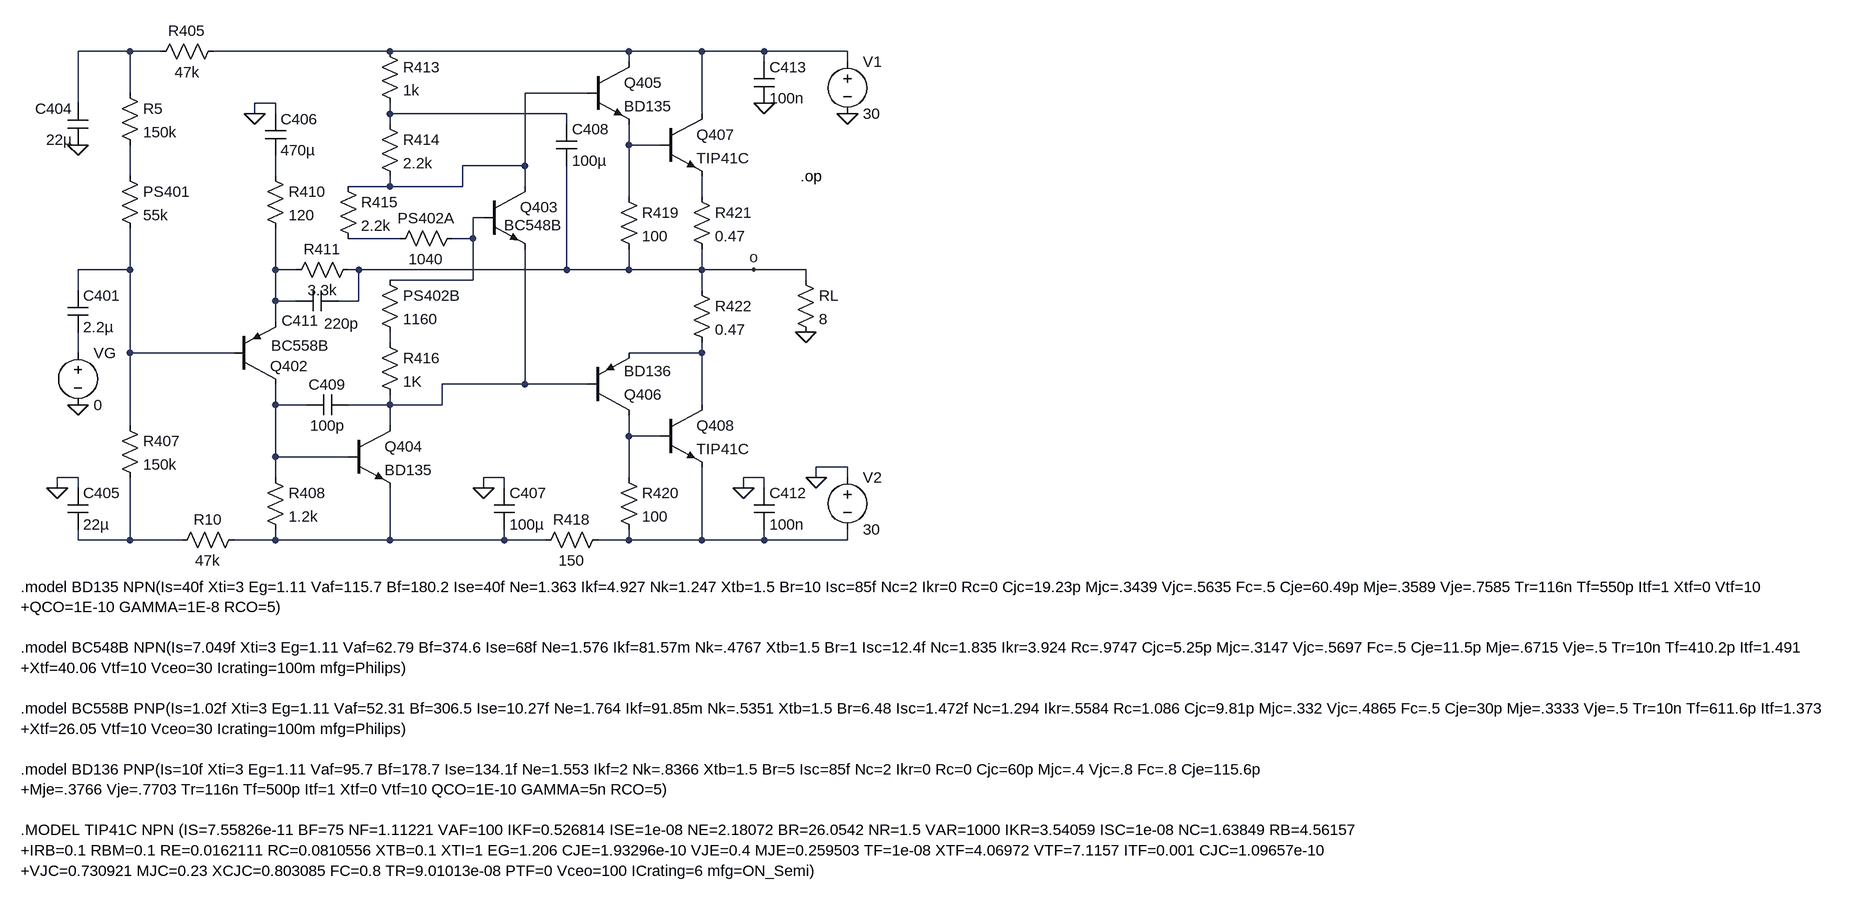
[diagram p0: schematic Polarizacion.asc]
Polarizacion.asc, the LTspice schematic file:
Version 4
SHEET 1 2364 864
WIRE -688 -368 -768 -368
WIRE -640 -368 -688 -368
WIRE -288 -368 -560 -368
WIRE 80 -368 -288 -368
WIRE 192 -368 80 -368
WIRE 288 -368 192 -368
WIRE 416 -368 288 -368
WIRE 80 -352 80 -368
WIRE 288 -352 288 -368
WIRE 416 -352 416 -368
WIRE -688 -304 -688 -368
WIRE 16 -304 -80 -304
WIRE -768 -288 -768 -368
WIRE -464 -288 -496 -288
WIRE -496 -272 -496 -288
WIRE -464 -272 -464 -288
WIRE -288 -272 -288 -288
WIRE -16 -272 -288 -272
WIRE 192 -272 192 -368
WIRE -288 -256 -288 -272
WIRE -16 -256 -16 -272
WIRE 80 -224 80 -256
WIRE 128 -224 80 -224
WIRE -80 -192 -80 -304
WIRE -80 -192 -176 -192
WIRE -688 -176 -688 -224
WIRE -464 -176 -464 -208
WIRE -288 -160 -288 -176
WIRE -288 -160 -352 -160
WIRE -176 -160 -176 -192
WIRE -176 -160 -288 -160
WIRE -80 -160 -80 -192
WIRE 80 -144 80 -224
WIRE 192 -144 192 -176
WIRE -144 -112 -160 -112
WIRE -272 -80 -352 -80
WIRE -160 -80 -160 -112
WIRE -160 -80 -192 -80
WIRE -688 -32 -688 -96
WIRE -688 -32 -768 -32
WIRE -464 -32 -464 -96
WIRE -432 -32 -464 -32
WIRE -336 -32 -352 -32
WIRE -16 -32 -16 -192
WIRE -16 -32 -336 -32
WIRE 80 -32 80 -64
WIRE 80 -32 -16 -32
WIRE 192 -32 192 -64
WIRE 192 -32 80 -32
WIRE 272 -32 192 -32
WIRE 352 -32 272 -32
WIRE -160 -16 -160 -80
WIRE -160 -16 -288 -16
WIRE 352 -16 352 -32
WIRE -768 0 -768 -32
WIRE 192 0 192 -32
WIRE -464 16 -464 -32
WIRE -432 16 -464 16
WIRE -336 16 -336 -32
WIRE -336 16 -368 16
WIRE -464 48 -464 16
WIRE -288 80 -288 64
WIRE -768 96 -768 64
WIRE -688 96 -688 -32
WIRE -528 96 -688 96
WIRE 192 96 192 80
WIRE 192 96 80 96
WIRE -80 144 -80 -64
WIRE -80 144 -208 144
WIRE 16 144 -80 144
WIRE -464 176 -464 144
WIRE -416 176 -464 176
WIRE -288 176 -288 160
WIRE -288 176 -352 176
WIRE -208 176 -208 144
WIRE -208 176 -288 176
WIRE 192 176 192 96
WIRE -688 208 -688 96
WIRE -288 208 -288 176
WIRE 80 224 80 192
WIRE 128 224 80 224
WIRE -464 256 -464 176
WIRE -352 256 -464 256
WIRE 416 272 368 272
WIRE -768 288 -800 288
WIRE -464 288 -464 256
WIRE -112 288 -144 288
WIRE 80 288 80 224
WIRE 288 288 256 288
WIRE 368 288 368 272
WIRE 416 288 416 272
WIRE -800 304 -800 288
WIRE -768 304 -768 288
WIRE -144 304 -144 288
WIRE -112 304 -112 288
WIRE 256 304 256 288
WIRE 288 304 288 288
WIRE -768 384 -768 368
WIRE -688 384 -688 288
WIRE -688 384 -768 384
WIRE -608 384 -688 384
WIRE -464 384 -464 368
WIRE -464 384 -528 384
WIRE -288 384 -288 304
WIRE -288 384 -464 384
WIRE -112 384 -112 368
WIRE -112 384 -288 384
WIRE -48 384 -112 384
WIRE 80 384 80 368
WIRE 80 384 32 384
WIRE 192 384 192 272
WIRE 192 384 80 384
WIRE 288 384 288 368
WIRE 288 384 192 384
WIRE 416 384 416 368
WIRE 416 384 288 384
FLAG -768 -224 0
FLAG -768 176 0
FLAG -496 -272 0
FLAG 288 -288 0
FLAG 256 304 0
FLAG 368 288 0
FLAG -800 304 0
FLAG 352 64 0
FLAG 416 -272 0
FLAG -144 304 0
FLAG 272 -32 o
SYMBOL res -704 -320 R0
SYMATTR InstName R5
SYMATTR Value 150k
SYMBOL res -544 -384 R90
WINDOW 0 0 56 VBottom 2
WINDOW 3 32 56 VTop 2
SYMATTR InstName R405
SYMATTR Value 47k
SYMBOL res -704 -192 R0
SYMATTR InstName PS401
SYMATTR Value 55k
SYMBOL cap -752 -224 R180
WINDOW 0 24 56 Left 2
WINDOW 3 24 8 Left 2
SYMATTR InstName C404
SYMATTR Value 22µ
SYMBOL res -704 192 R0
SYMATTR InstName R407
SYMATTR Value 150k
SYMBOL voltage -768 80 R0
SYMATTR InstName VG
SYMATTR Value 0
SYMBOL cap -784 0 R0
SYMATTR InstName C401
SYMATTR Value 2.2µ
SYMBOL pnp -528 144 M180
WINDOW 0 56 28 Left 2
WINDOW 3 57 59 Left 2
SYMATTR InstName Q402
SYMATTR Value BC558B
SYMBOL res -480 -192 R0
SYMATTR InstName R410
SYMATTR Value 120
SYMBOL cap -480 -272 R0
SYMATTR InstName C406
SYMATTR Value 470µ
SYMBOL res -480 272 R0
SYMATTR InstName R408
SYMATTR Value 1.2k
SYMBOL res -448 -16 R270
WINDOW 0 32 56 VTop 2
WINDOW 3 0 56 VBottom 2
SYMATTR InstName R411
SYMATTR Value 3.3k
SYMBOL res -304 -384 R0
SYMATTR InstName R413
SYMATTR Value 1k
SYMBOL res -304 -272 R0
SYMATTR InstName R414
SYMATTR Value 2.2k
SYMBOL res -368 -176 R0
SYMATTR InstName R415
SYMATTR Value 2.2k
SYMBOL res -304 -32 R0
SYMATTR InstName PS402B
SYMATTR Value 1160
SYMBOL res -304 64 R0
SYMATTR InstName R416
SYMATTR Value 1K
SYMBOL npn -352 208 R0
SYMATTR InstName Q404
SYMATTR Value BD135
SYMBOL npn -144 -160 R0
WINDOW 3 32 59 Left 2
SYMATTR Value BC548B
SYMATTR InstName Q403
SYMBOL npn 16 -352 R0
SYMATTR InstName Q405
SYMATTR Value BD135
SYMBOL npn 128 -272 R0
SYMATTR InstName Q407
SYMATTR Value TIP41C
SYMBOL npn 128 176 R0
SYMATTR InstName Q408
SYMATTR Value TIP41C
SYMBOL pnp 16 192 M180
SYMATTR InstName Q406
SYMATTR Value BD136
SYMBOL res 176 -160 R0
SYMATTR InstName R421
SYMATTR Value 0.47
SYMBOL res 64 -160 R0
SYMATTR InstName R419
SYMATTR Value 100
SYMBOL res 64 272 R0
SYMATTR InstName R420
SYMATTR Value 100
SYMBOL res 176 -16 R0
SYMATTR InstName R422
SYMATTR Value 0.47
SYMBOL cap 272 -352 R0
SYMATTR InstName C413
SYMATTR Value 100n
SYMBOL cap 272 304 R0
SYMATTR InstName C412
SYMATTR Value 100n
SYMBOL voltage 416 -368 R0
SYMATTR InstName V1
SYMATTR Value 30
SYMBOL voltage 416 272 R0
SYMATTR InstName V2
SYMATTR Value 30
SYMBOL res 336 -32 R0
SYMATTR InstName RL
SYMATTR Value 8
SYMBOL res -64 400 R270
WINDOW 0 32 56 VTop 2
WINDOW 3 0 56 VBottom 2
SYMATTR InstName R418
SYMATTR Value 150
SYMBOL res -624 400 R270
WINDOW 0 32 56 VTop 2
WINDOW 3 0 56 VBottom 2
SYMATTR InstName R10
SYMATTR Value 47k
SYMBOL cap -784 304 R0
SYMATTR InstName C405
SYMATTR Value 22µ
SYMBOL cap -128 304 R0
SYMATTR InstName C407
SYMATTR Value 100µ
SYMBOL cap -32 -256 R0
SYMATTR InstName C408
SYMATTR Value 100µ
SYMBOL cap -368 0 R90
WINDOW 0 62 58 VBottom 2
WINDOW 3 35 -6 VTop 2
SYMATTR InstName C411
SYMATTR Value 220p
SYMBOL cap -352 160 R90
WINDOW 0 0 32 VBottom 2
WINDOW 3 32 32 VTop 2
SYMATTR InstName C409
SYMATTR Value 100p
SYMBOL res -288 -64 R270
WINDOW 0 32 56 VTop 2
WINDOW 3 0 56 VBottom 2
SYMATTR InstName PS402A
SYMATTR Value 1040
TEXT 344 -176 Left 2 !.op
TEXT -856 456 Left 2 !.model BD135 NPN(Is=40f Xti=3 Eg=1.11 Vaf=115.7 Bf=180.2 Ise=40f Ne=1.363 Ikf=4.927 Nk=1.247 Xtb=1.5 Br=10 Isc=85f Nc=2 Ikr=0 Rc=0 Cjc=19.23p Mjc=.3439 Vjc=.5635 Fc=.5 Cje=60.49p Mje=.3589 Vje=.7585 Tr=116n Tf=550p Itf=1 Xtf=0 Vtf=10 \n+QCO=1E-10 GAMMA=1E-8 RCO=5)\n \n.model BC548B NPN(Is=7.049f Xti=3 Eg=1.11 Vaf=62.79 Bf=374.6 Ise=68f Ne=1.576 Ikf=81.57m Nk=.4767 Xtb=1.5 Br=1 Isc=12.4f Nc=1.835 Ikr=3.924 Rc=.9747 Cjc=5.25p Mjc=.3147 Vjc=.5697 Fc=.5 Cje=11.5p Mje=.6715 Vje=.5 Tr=10n Tf=410.2p Itf=1.491 \n+Xtf=40.06 Vtf=10 Vceo=30 Icrating=100m mfg=Philips)\n \n.model BC558B PNP(Is=1.02f Xti=3 Eg=1.11 Vaf=52.31 Bf=306.5 Ise=10.27f Ne=1.764 Ikf=91.85m Nk=.5351 Xtb=1.5 Br=6.48 Isc=1.472f Nc=1.294 Ikr=.5584 Rc=1.086 Cjc=9.81p Mjc=.332 Vjc=.4865 Fc=.5 Cje=30p Mje=.3333 Vje=.5 Tr=10n Tf=611.6p Itf=1.373 \n+Xtf=26.05 Vtf=10 Vceo=30 Icrating=100m mfg=Philips)\n \n.model BD136 PNP(Is=10f Xti=3 Eg=1.11 Vaf=95.7 Bf=178.7 Ise=134.1f Ne=1.553 Ikf=2 Nk=.8366 Xtb=1.5 Br=5 Isc=85f Nc=2 Ikr=0 Rc=0 Cjc=60p Mjc=.4 Vjc=.8 Fc=.8 Cje=115.6p\n+Mje=.3766 Vje=.7703 Tr=116n Tf=500p Itf=1 Xtf=0 Vtf=10 QCO=1E-10 GAMMA=5n RCO=5)\n \n.MODEL TIP41C NPN (IS=7.55826e-11 BF=75 NF=1.11221 VAF=100 IKF=0.526814 ISE=1e-08 NE=2.18072 BR=26.0542 NR=1.5 VAR=1000 IKR=3.54059 ISC=1e-08 NC=1.63849 RB=4.56157\n+IRB=0.1 RBM=0.1 RE=0.0162111 RC=0.0810556 XTB=0.1 XTI=1 EG=1.206 CJE=1.93296e-10 VJE=0.4 MJE=0.259503 TF=1e-08 XTF=4.06972 VTF=7.1157 ITF=0.001 CJC=1.09657e-10\n+VJC=0.730921 MJC=0.23 XCJC=0.803085 FC=0.8 TR=9.01013e-08 PTF=0 Vceo=100 ICrating=6 mfg=ON_Semi)

The netlist it stands for:
* Polarizacion.asc
R5 N001 N006 150k
R405 N002 N001 47k
R§PS401 N006 N011 55k
C404 0 N001 22µ
R407 N011 N019 150k
VG N014 0 0
C401 N011 N014 2.2µ
Q402 N017 N011 N012 0 BC558B
R410 N007 N012 120
C406 0 N007 470µ
R408 N017 N020 1.2k
R411 N012 o 3.3k
R413 N002 N004 1k
R414 N004 N003 2.2k
R415 N003 N010 2.2k
R§PS402B N009 N013 1160
R416 N013 N016 1K
Q404 N016 N017 N020 0 BD135
Q403 N003 N009 N016 0 BC548B
Q405 N002 N003 N005 0 BD135
Q407 N002 N005 N008 0 TIP41C
Q408 N015 N018 N021 0 TIP41C
Q406 N018 N016 N015 0 BD136
R421 N008 o 0.47
R419 N005 o 100
R420 N018 N021 100
R422 o N015 0.47
C413 N002 0 100n
C412 0 N021 100n
V1 N002 0 30
V2 0 N021 30
RL o 0 8
R418 N020 N021 150
R10 N019 N020 47k
C405 0 N019 22µ
C407 0 N020 100µ
C408 N004 o 100µ
C411 o N012 220p
C409 N016 N017 100p
R§PS402A N010 N009 1040
.model NPN NPN
.model PNP PNP
.lib standard.bjt
.op
.model BD135 NPN(Is=40f Xti=3 Eg=1.11 Vaf=115.7 Bf=180.2 Ise=40f Ne=1.363 Ikf=4.927 Nk=1.247 Xtb=1.5 Br=10 Isc=85f Nc=2 Ikr=0 Rc=0 Cjc=19.23p Mjc=.3439 Vjc=.5635 Fc=.5 Cje=60.49p Mje=.3589 Vje=.7585 Tr=116n Tf=550p Itf=1 Xtf=0 Vtf=10
+QCO=1E-10 GAMMA=1E-8 RCO=5)
.model BC548B NPN(Is=7.049f Xti=3 Eg=1.11 Vaf=62.79 Bf=374.6 Ise=68f Ne=1.576 Ikf=81.57m Nk=.4767 Xtb=1.5 Br=1 Isc=12.4f Nc=1.835 Ikr=3.924 Rc=.9747 Cjc=5.25p Mjc=.3147 Vjc=.5697 Fc=.5 Cje=11.5p Mje=.6715 Vje=.5 Tr=10n Tf=410.2p Itf=1.491
+Xtf=40.06 Vtf=10 Vceo=30 Icrating=100m mfg=Philips)
.model BC558B PNP(Is=1.02f Xti=3 Eg=1.11 Vaf=52.31 Bf=306.5 Ise=10.27f Ne=1.764 Ikf=91.85m Nk=.5351 Xtb=1.5 Br=6.48 Isc=1.472f Nc=1.294 Ikr=.5584 Rc=1.086 Cjc=9.81p Mjc=.332 Vjc=.4865 Fc=.5 Cje=30p Mje=.3333 Vje=.5 Tr=10n Tf=611.6p Itf=1.373
+Xtf=26.05 Vtf=10 Vceo=30 Icrating=100m mfg=Philips)
.model BD136 PNP(Is=10f Xti=3 Eg=1.11 Vaf=95.7 Bf=178.7 Ise=134.1f Ne=1.553 Ikf=2 Nk=.8366 Xtb=1.5 Br=5 Isc=85f Nc=2 Ikr=0 Rc=0 Cjc=60p Mjc=.4 Vjc=.8 Fc=.8 Cje=115.6p
+Mje=.3766 Vje=.7703 Tr=116n Tf=500p Itf=1 Xtf=0 Vtf=10 QCO=1E-10 GAMMA=5n RCO=5)
.MODEL TIP41C NPN (IS=7.55826e-11 BF=75 NF=1.11221 VAF=100 IKF=0.526814 ISE=1e-08 NE=2.18072 BR=26.0542 NR=1.5 VAR=1000 IKR=3.54059 ISC=1e-08 NC=1.63849 RB=4.56157
+IRB=0.1 RBM=0.1 RE=0.0162111 RC=0.0810556 XTB=0.1 XTI=1 EG=1.206 CJE=1.93296e-10 VJE=0.4 MJE=0.259503 TF=1e-08 XTF=4.06972 VTF=7.1157 ITF=0.001 CJC=1.09657e-10
+VJC=0.730921 MJC=0.23 XCJC=0.803085 FC=0.8 TR=9.01013e-08 PTF=0 Vceo=100 ICrating=6 mfg=ON_Semi)
.backanno
.end